# Altium schematic sheet Dimmer.SchDoc
size A4
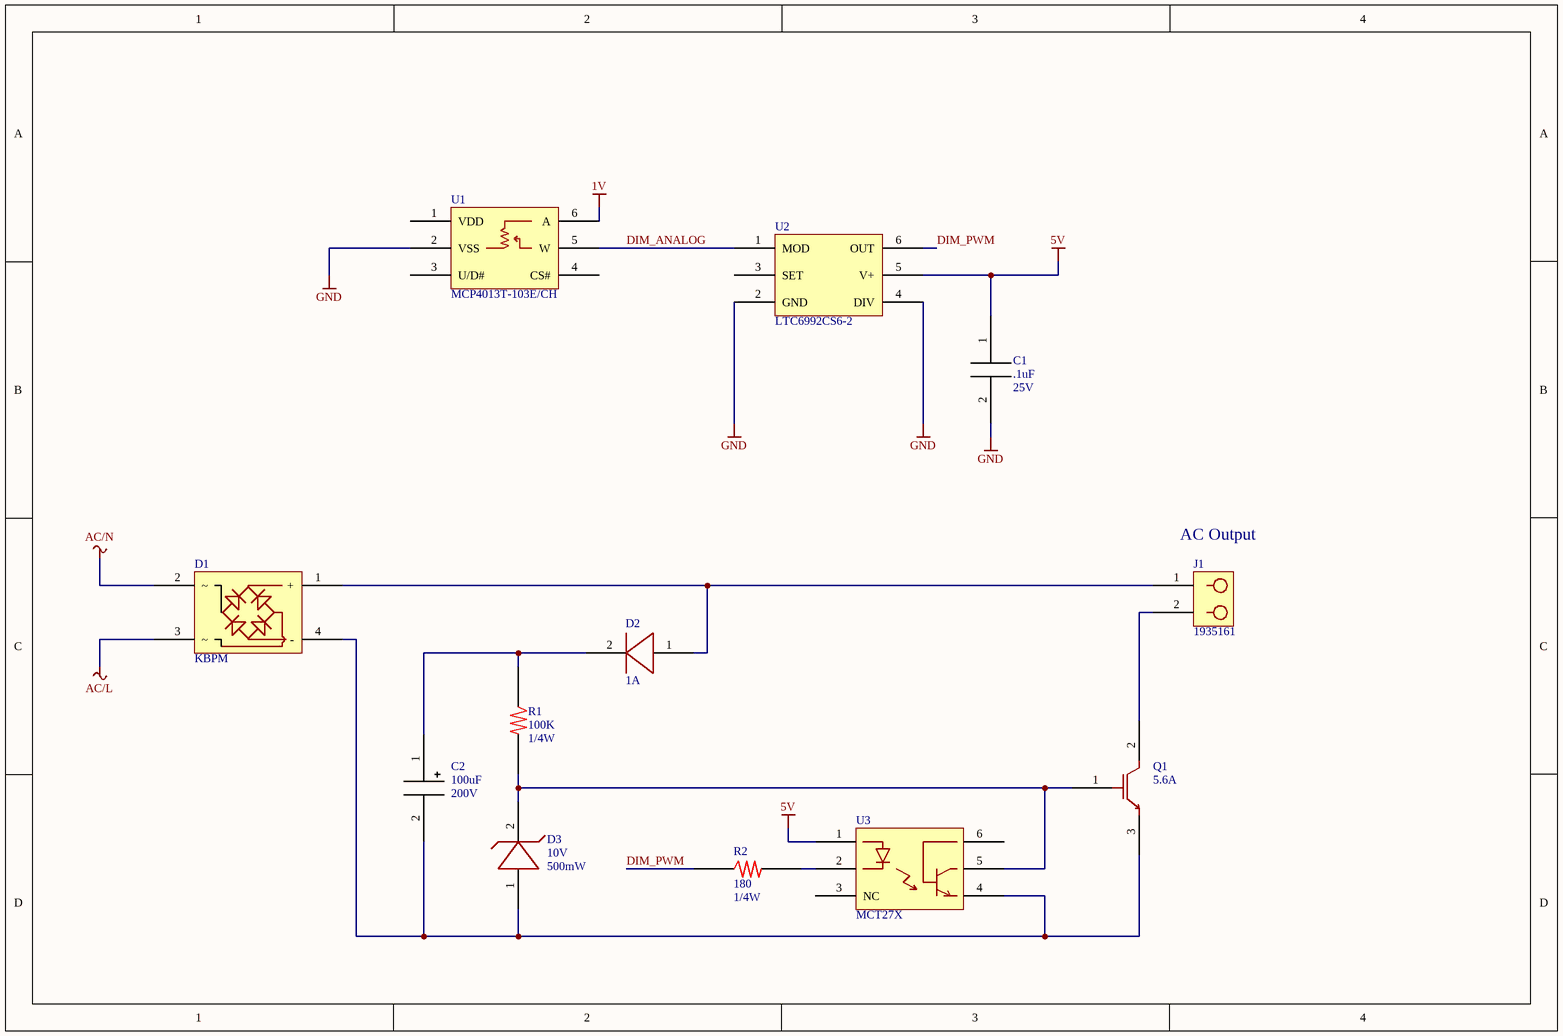
[diagram p0: Dimmer.SchDoc]

## Parts
C1  value .1uF  Rating: 25V  [1206]  (hidden comment: CAP)
C2  value 100uF  Rating: 200V  [CAPM7]  (hidden comment: CAP)
D1  KBPM  [KBPM]
D2  Rating: 1A  [DO41]  (hidden comment: DIODE)
D3  value 10V  Rating: 500mW  [DO35]  (hidden comment: ZENER)
J1  1935161  [1935161]
Q1  Rating: 5.6A  [TO-220AB]  (hidden comment: Q_IRF510_TO-220AB)
R1  value 100K  Rating: 1/4W  [1206]  (hidden comment: R_RES_1206)
R2  value 180  Rating: 1/4W  [1206]  (hidden comment: R_RES_1206)
U1  MCP4013T-103E/CH  [SOT23-6]
U2  LTC6992CS6-2  [SOT23-6]
U3  MCT27X  [DIP6]

## Nets
1V: U1.6(A)
5V: C1.1 U2.5(V+) U3.1
AC/L: D1.3
AC/N: D1.2
GND: C1.2 U1.2(VSS) U2.2(GND) U2.4(DIV)
DIM_ANALOG: U1.5(W) U2.1(MOD)
DIM_PWM: R2.1 U2.6(OUT)
NetC2_1: C2.1 D2.2 R1.1
NetC2_2: C2.2 D1.4(-) D3.1 Q1.3(S) U3.4
NetD1_1: D1.1(+) D2.1 J1.1
NetD3_2: D3.2 Q1.1(G) R1.2 U3.5
NetJ1_2: J1.2 Q1.2(D)
NetR2_2: R2.2 U3.2

Not connected (* = marked no-connect by the designer): U1 1(VDD) 3(U/D#) 4(CS#); U2 3(SET); U3 3(NC) 6

## Notes on the sheet
- (near J1) AC Output

## Library data of the parts
C1 = C_CAP_1206
C2 = C_CAPP_CAPM7
D1 = D_KBPM_KBMP
D2 = D_DIODE_DO41
D3 = D_ZENER_DO35
J1 = J_2POSTERM_1935161
U1 = U_ MCP4013T-103E/CH_SOT23-6
U2 = U_LTC6992CS6-2_SOT23-6
U3 = U_MCT27X_DIP6